# EAGLE schematic WBDR_02 (EAGLE 9.6.2)
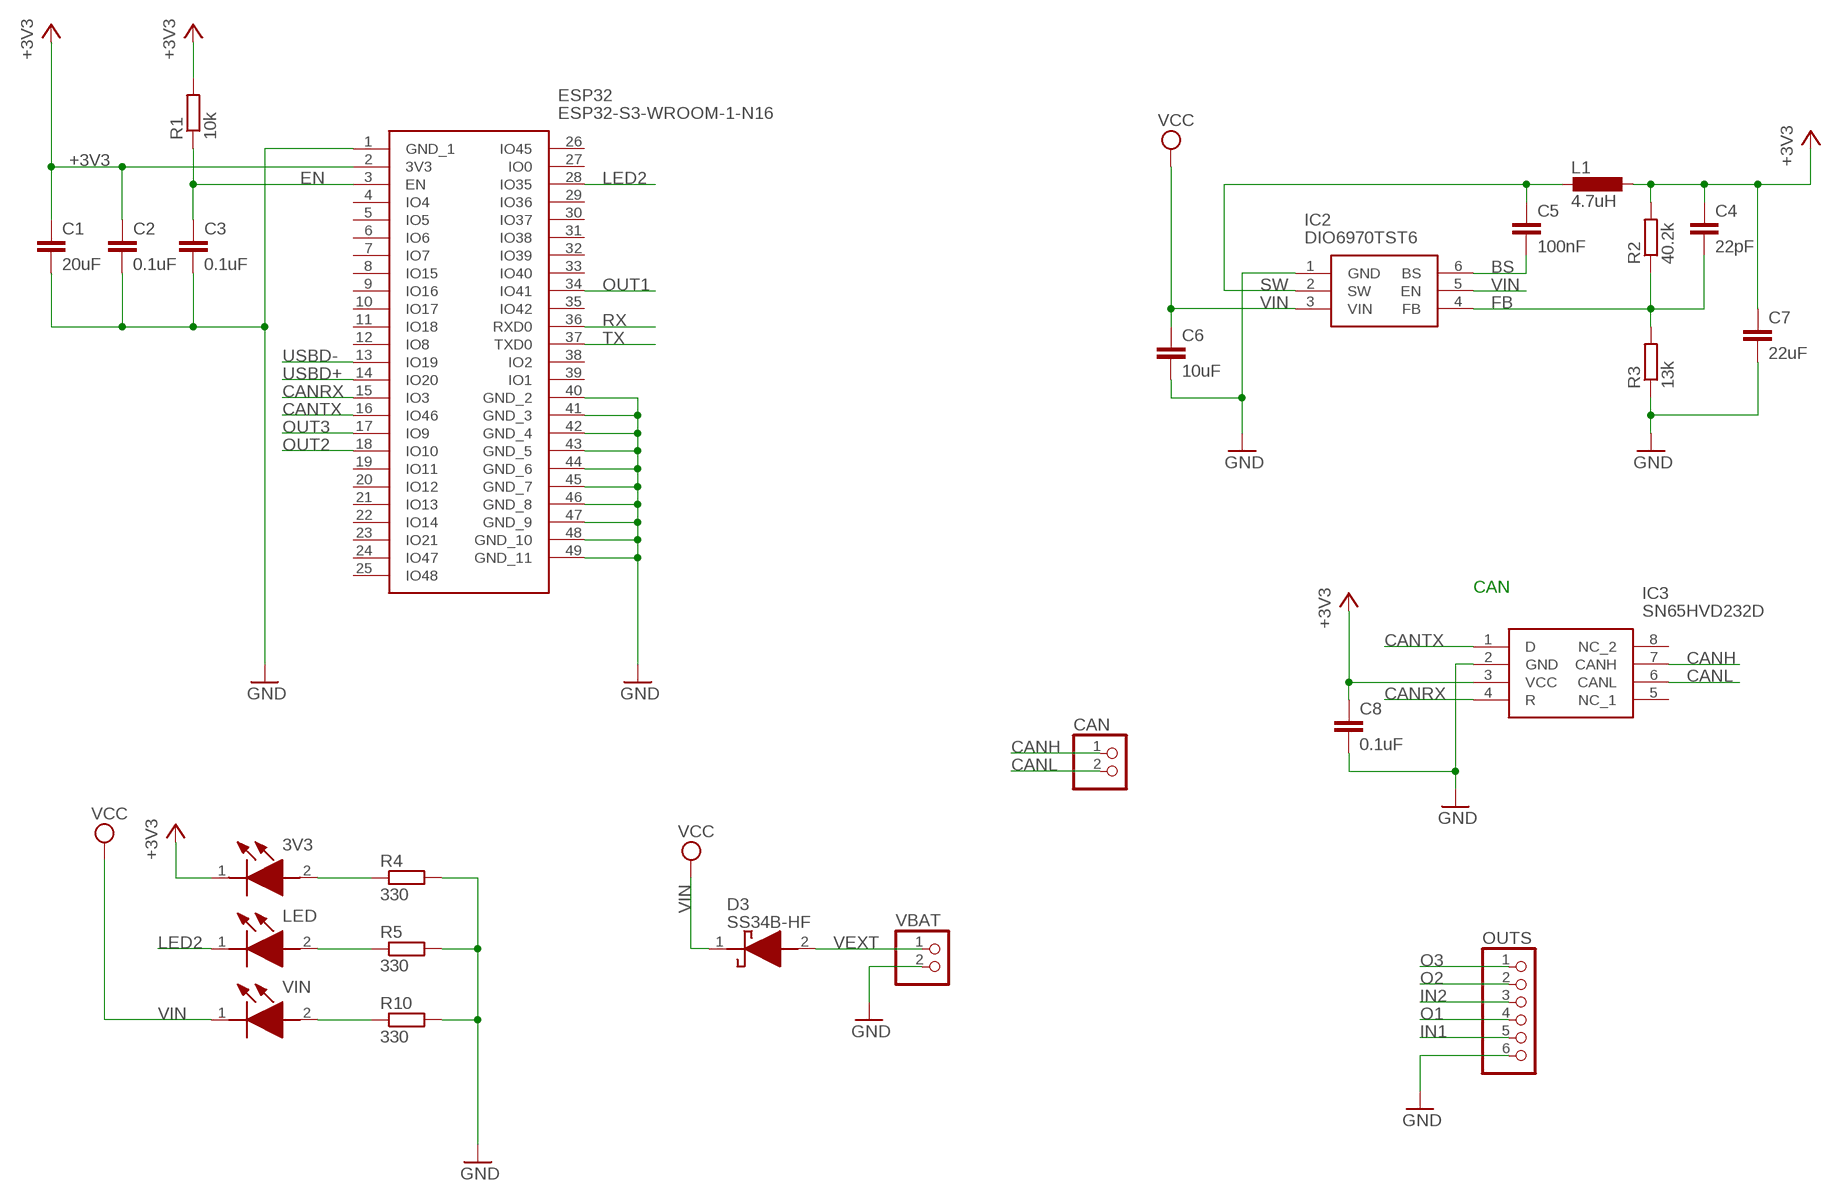
[diagram p0: schematic, sheet 1, part 1 of 2]
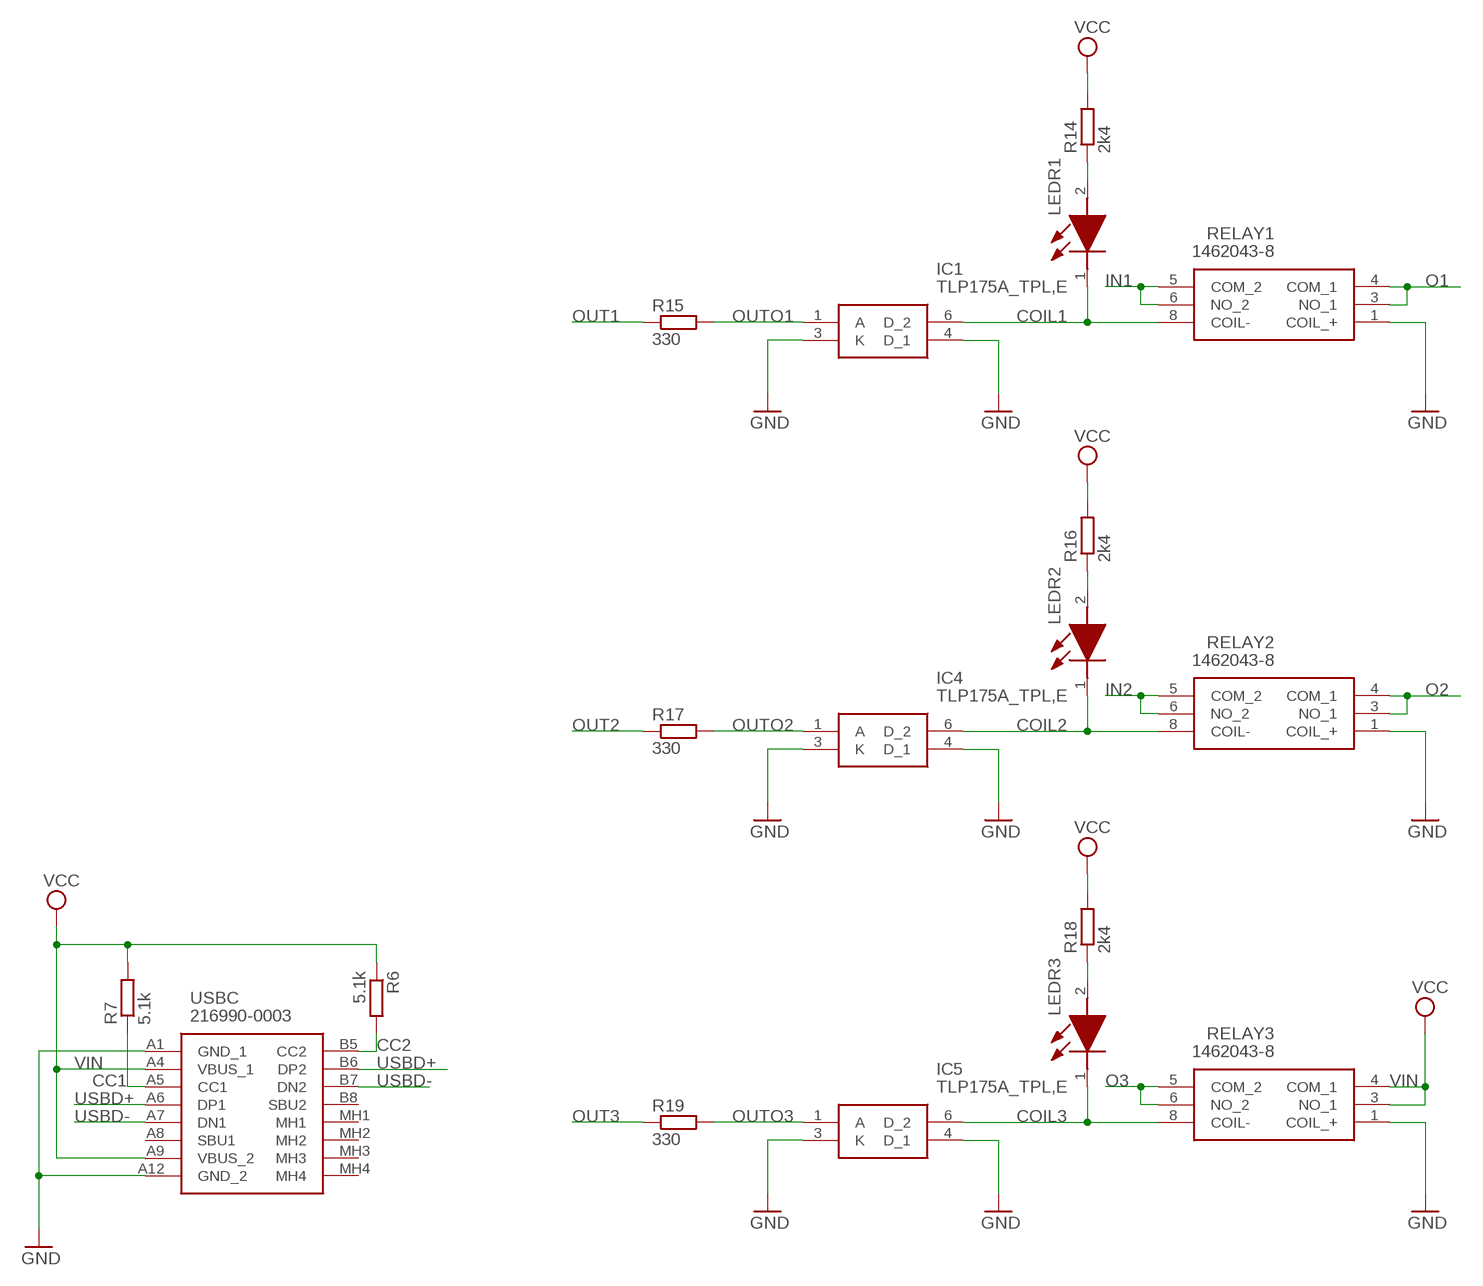
[diagram p1: schematic, sheet 1, part 2 of 2]

## Parts
3V3  150060GS75000  [LEDC1608X80N]
C1  20uF  C-EUC0603  [C0603]
C2  0.1uF  C-EUC0603  [C0603]
C3  0.1uF  C-EUC0603  [C0603]
C4  22pF  C-EUC0603  [C0603]
C5  100nF  C-EUC0603  [C0603]
C6  10uF  C-EUC0603  [C0603]
C7  22uF  C-EUC0603  [C0603]
C8  0.1uF  C-EUC0603  [C0603]
CAN  PINHD-1X2  [1X02]
D3  SS34B-HF  [DIOM5336X320N]
ESP32  ESP32-S3-WROOM-1-N16  [ESP32S3WROOM1N16]
IC1  TLP175A_TPL,E  [TLP266J]
IC2  DIO6970TST6  [SOT95P280X90-6N]
IC3  SN65HVD232D  [SOIC127P600X175-8N]
IC4  TLP175A_TPL,E  [TLP266J]
IC5  TLP175A_TPL,E  [TLP266J]
L1  4.7uH  L-EUL5650M  [L5650M]
LED  150060GS75000  [LEDC1608X80N]
LEDR1  150060GS75000  [LEDC1608X80N]
LEDR2  150060GS75000  [LEDC1608X80N]
LEDR3  150060GS75000  [LEDC1608X80N]
OUTS  PINHD-1X6  [1X06]
R1  10k  R-EU_R0603  [R0603]
R2  40.2k  R-EU_R0603  [R0603]
R3  13k  R-EU_R0603  [R0603]
R4  330  R-EU_R0603  [R0603]
R5  330  R-EU_R0603  [R0603]
R6  5.1k  R-EU_R0603  [R0603]
R7  5.1k  R-EU_R0603  [R0603]
R10  330  R-EU_R0603  [R0603]
R14  2k4  R-EU_R0603  [R0603]
R15  330  R-EU_R0603  [R0603]
R16  2k4  R-EU_R0603  [R0603]
R17  330  R-EU_R0603  [R0603]
R18  2k4  R-EU_R0603  [R0603]
R19  330  R-EU_R0603  [R0603]
RELAY1  1462043-8  [14620438]
RELAY2  1462043-8  [14620438]
RELAY3  1462043-8  [14620438]
USBC  216990-0003  [2169900003]
VBAT  PINHD-1X2  [1X02]
VIN  150060GS75000  [LEDC1608X80N]

## Nets
+3V3: 3V3.1(K) C1.1 C2.1 C4.1 C7.1 C8.1 ESP32.2(3V3) IC3.3(VCC) L1.1 R1.2 R2.2
BS: C5.2 IC2.6(BS)
CANH: CAN.1 IC3.7(CANH)
CANL: CAN.2 IC3.6(CANL)
CANRX: ESP32.15(IO3) IC3.4(R)
CANTX: ESP32.16(IO46) IC3.1(D)
CC1: R7.1 USBC.A5(CC1)
CC2: R6.2 USBC.B5(CC2)
COIL1: IC1.6(D_2) LEDR1.1(K) RELAY1.8(COIL-)
COIL2: IC4.6(D_2) LEDR2.1(K) RELAY2.8(COIL-)
COIL3: IC5.6(D_2) LEDR3.1(K) RELAY3.8(COIL-)
EN: C3.1 ESP32.3(EN) R1.1
FB: C4.2 IC2.4(FB) R2.1 R3.2
GND: C1.2 C2.2 C3.2 C6.2 C7.2 C8.2 ESP32.1(GND_1) ESP32.40(GND_2) ESP32.41(GND_3) ESP32.42(GND_4) ESP32.43(GND_5) ESP32.44(GND_6) ESP32.45(GND_7) ESP32.46(GND_8) ESP32.47(GND_9) ESP32.48(GND_10) ESP32.49(GND_11) IC1.3(K) IC1.4(D_1) IC2.1(GND) IC3.2(GND) IC4.3(K) IC4.4(D_1) IC5.3(K) IC5.4(D_1) OUTS.6 R3.1 R4.2 R5.2 R10.2 RELAY1.1(COIL_+) RELAY2.1(COIL_+) RELAY3.1(COIL_+) USBC.A1(GND_1) USBC.A12(GND_2) VBAT.2
IN1: OUTS.5 RELAY1.5(COM_2) RELAY1.6(NO_2)
IN2: OUTS.3 RELAY2.5(COM_2) RELAY2.6(NO_2)
LDR1: 3V3.2(A) R4.1
LDR2: LED.2(A) R5.1
LDR3: R10.1 VIN.2(A)
LED2: ESP32.28(IO35) LED.1(K)
LEDCOIL1: LEDR1.2(A) R14.1
LEDCOIL2: LEDR2.2(A) R16.1
LEDCOIL3: LEDR3.2(A) R18.1
O1: OUTS.4 RELAY1.3(NO_1) RELAY1.4(COM_1)
O2: OUTS.2 RELAY2.3(NO_1) RELAY2.4(COM_1)
O3: OUTS.1 RELAY3.5(COM_2) RELAY3.6(NO_2)
OUT1: ESP32.34(IO41) R15.1
OUT2: ESP32.18(IO10) R17.1
OUT3: ESP32.17(IO9) R19.1
OUTO1: IC1.1(A) R15.2
OUTO2: IC4.1(A) R17.2
OUTO3: IC5.1(A) R19.2
RX: ESP32.36(RXD0)
SW: C5.1 IC2.2(SW) L1.2
TX: ESP32.37(TXD0)
USBD+: ESP32.14(IO20) USBC.A6(DP1) USBC.B6(DP2)
USBD-: ESP32.13(IO19) USBC.A7(DN1) USBC.B7(DN2)
VEXT: D3.2(A) VBAT.1
VIN: C6.1 D3.1(K) IC2.3(VIN) IC2.5(EN) R6.1 R7.2 R14.2 R16.2 R18.2 RELAY3.3(NO_1) RELAY3.4(COM_1) USBC.A4(VBUS_1) USBC.A9(VBUS_2) VIN.1(K) ; supply symbol labelled VCC
Unconnected: ESP32.4(IO4) ESP32.5(IO5) ESP32.6(IO6) ESP32.7(IO7) ESP32.8(IO15) ESP32.9(IO16) ESP32.10(IO17) ESP32.11(IO18) ESP32.12(IO8) ESP32.19(IO11) ESP32.20(IO12) ESP32.21(IO13) ESP32.22(IO14) ESP32.23(IO21) ESP32.24(IO47) ESP32.25(IO48) ESP32.26(IO45) ESP32.27(IO0) ESP32.29(IO36) ESP32.30(IO37) ESP32.31(IO38) ESP32.32(IO39) ESP32.33(IO40) ESP32.35(IO42) ESP32.38(IO2) ESP32.39(IO1) IC3.5(NC_1) IC3.8(NC_2) USBC.A8(SBU1) USBC.B8(SBU2) USBC.MH1 USBC.MH2 USBC.MH3 USBC.MH4

## Notes on the sheet
- CAN

## Library data of the parts
3V3 LED LEDR1-LEDR3 VIN = SamacSys_Parts:150060GS75000: Wurth Elektronik WL-SMCW 520 nm Green LED, 1608 (0603) Clear SMD package Source: Datasheet <https://componentsearchengine.com/Datasheets/2/150060GS75000.pdf>; DESCRIPTION: Wurth Elektronik WL-SMCW 520 nm Green LED, 1608 (0603) Clear SMD package; HEIGHT: 0.8mm; MANUFACTURER_NAME: Wurth Elektronik; MANUFACTURER_PART_NUMBER: 150060GS75000; MOUSER_PART_NUMBER: 710-150060GS75000; MOUSER_PRICE-STOCK: https://www.mouser.co.uk/ProductDetail/Wurth-Elektronik/150060GS75000?qs=LlUlMxKIyB0UYkq5lDO8nA%3D%3D
C1-C8 = rcl:C-EU: CAPACITOR, European symbol
CAN VBAT = pinhead:PINHD-1X2: PIN HEADER
D3 = SamacSys_Parts:SS34B-HF: Schottky Diodes & Rectifiers DIODE SCHOTTKY 3A 40V SMB Source: Datasheet <https://www.mouser.jp/datasheet/2/80/SP-JB017_SS34B-HF_Thru._SS320B-HF_RevB-1847021.pdf>; DESCRIPTION: Schottky Diodes & Rectifiers DIODE SCHOTTKY 3A 40V SMB; HEIGHT: 3.2mm; MANUFACTURER_NAME: Comchip Technology; MANUFACTURER_PART_NUMBER: SS34B-HF; MOUSER_PART_NUMBER: 750-SS34B-HF; MOUSER_PRICE-STOCK: https://www.mouser.co.uk/ProductDetail/Comchip-Technology/SS34B-HF?qs=vmHwEFxEFR9G1M%252BcUPG%2FxQ%3D%3D
ESP32 = ESP32-S3-WROOM-1-N16:ESP32-S3-WROOM-1-N16: WiFi Modules - 802.11 [Engineering Samples] SMD Module, ESP32-S3, 16 MB SPI Flash, PCB Antenna Source: Datasheet <https://www.espressif.com/sites/default/files/documentation/esp32-s3-wroom-1_wroom-1u_datasheet_en.pdf>; DESCRIPTION: WiFi Modules - 802.11 [Engineering Samples] SMD Module, ESP32-S3, 16 MB SPI Flash, PCB Antenna; HEIGHT: 3.25mm; MANUFACTURER_NAME: Espressif Systems; MANUFACTURER_PART_NUMBER: ESP32-S3-WROOM-1-N16; MOUSER_PART_NUMBER: 356-ESP32S3WROOM1N16; MOUSER_PRICE-STOCK: https://www.mouser.co.uk/ProductDetail/Espressif-Systems/ESP32-S3-WROOM-1-N16?qs=Li%252BoUPsLEntjPrtJwwS5Pw%3D%3D
IC1 IC4 IC5 = SamacSys_Parts:TLP175A_TPL,E: MOSFET Output Optocouplers Trigger LED Current 1mA85dC3750 Vrms Source: Datasheet <http://toshiba.semicon-storage.com/info/docget.jsp?did=13665&prodName=TLP175A>; DESCRIPTION: MOSFET Output Optocouplers Trigger LED Current 1mA85dC3750 Vrms; HEIGHT: 2mm; MANUFACTURER_NAME: Toshiba; MANUFACTURER_PART_NUMBER: TLP175A(TPL,E; MOUSER_PART_NUMBER: 757-TLP175A(TPLE; MOUSER_PRICE-STOCK: https://www.mouser.co.uk/ProductDetail/Toshiba/TLP175ATPLE?qs=HVbQlW5zcXXp9ILK7hvmMw%3D%3D
IC2 = SamacSys_Parts:DIO6970TST6: Switching Voltage Regulators 2A Step Converter 24V Input Sync Source: Datasheet; DESCRIPTION: Switching Voltage Regulators 2A Step Converter 24V Input Sync; HEIGHT: 0.9mm; MANUFACTURER_NAME: DIOO Microcircuits; MANUFACTURER_PART_NUMBER: DIO6970TST6; MOUSER_PART_NUMBER: 453-DIO6970ST6; MOUSER_PRICE-STOCK: https://www.mouser.co.uk/ProductDetail/DIOO-Microcircuits/DIO6970TST6?qs=%252BEew9%252B0nqrCWpKu8WqElxA%3D%3D
IC3 = SamacSys_Parts:SN65HVD232D: CAN Transceiver 1Mbit/s ISO 11898, 8-Pin SOIC Source: Datasheet <http://www.ti.com/lit/ds/symlink/sn65hvd232.pdf>; DESCRIPTION: CAN Transceiver 1Mbit/s ISO 11898, 8-Pin SOIC; HEIGHT: 1.75mm; MANUFACTURER_NAME: Texas Instruments; MANUFACTURER_PART_NUMBER: SN65HVD232D; MOUSER_PART_NUMBER: 595-SN65HVD232D; MOUSER_PRICE-STOCK: https://www.mouser.co.uk/ProductDetail/Texas-Instruments/SN65HVD232D?qs=QViXGNcIEAueLIS9b8IyYg%3D%3D
L1 = rcl:L-EU: INDUCTOR, European symbol; SPICEPREFIX: L
OUTS = pinhead:PINHD-1X6: PIN HEADER
R1-R7 R10 R14-R19 = rcl:R-EU_: RESISTOR, European symbol; SPICEPREFIX: R
RELAY1-RELAY3 = SamacSys_Parts:1462043-8: Low Signal Relays - PCB IME06TS=140MW 12V 2NO Source: Datasheet <https://www.te.com/commerce/DocumentDelivery/DDEController?Action=showdoc&DocId=Specification Or Standard108-98001W5pdfEnglishENG_SS_108-98001_W5.pdf1462043-8>; DESCRIPTION: Low Signal Relays - PCB IME06TS=140MW 12V 2NO; HEIGHT: 5.65mm; MANUFACTURER_NAME: TE Connectivity; MANUFACTURER_PART_NUMBER: 1462043-8; MOUSER_PART_NUMBER: 655-1462043-8; MOUSER_PRICE-STOCK: https://www.mouser.co.uk/ProductDetail/TE-Connectivity-PB/1462043-8/?qs=kSbAZawwBnx8XxDvaHw46A%3D%3D
USBC = SamacSys_Parts:216990-0003: USB Connectors Mid-Mnt SMT CH0.58 16Ckt Type C Rec. Source: Datasheet <https://www.molex.com/pdm_docs/sd/2169900003_sd.pdf>; DESCRIPTION: USB Connectors Mid-Mnt SMT CH0.58 16Ckt Type C Rec.; HEIGHT: 3.36mm; MANUFACTURER_NAME: Molex; MANUFACTURER_PART_NUMBER: 216990-0003; MOUSER_PART_NUMBER: 538-216990-0003; MOUSER_PRICE-STOCK: https://www.mouser.co.uk/ProductDetail/Molex/216990-0003?qs=DRkmTr78QASn0GILUGAYCA%3D%3D